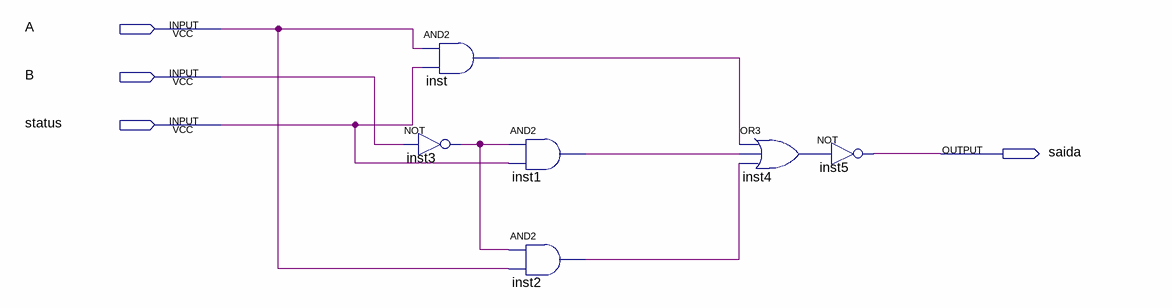
[diagram p0: schematic sheet]
// Quartus schematic Menorque.bdf as structural Verilog: 6 symbols, 4 pins
module Menorque (
  input  A,
  input  B,
  input  status,
  output saida
);

  wire inst1_out, inst2_out, inst3_out, inst4_out, inst_out;

  and inst (inst_out, A, status);
  not inst3 (inst3_out, B);
  and inst1 (inst1_out, inst3_out, status);
  and inst2 (inst2_out, inst3_out, A);
  or inst4 (inst4_out, inst_out, inst1_out, inst2_out);
  not inst5 (saida, inst4_out);
endmodule
